# EAGLE schematic pi (EAGLE 9.6.2)
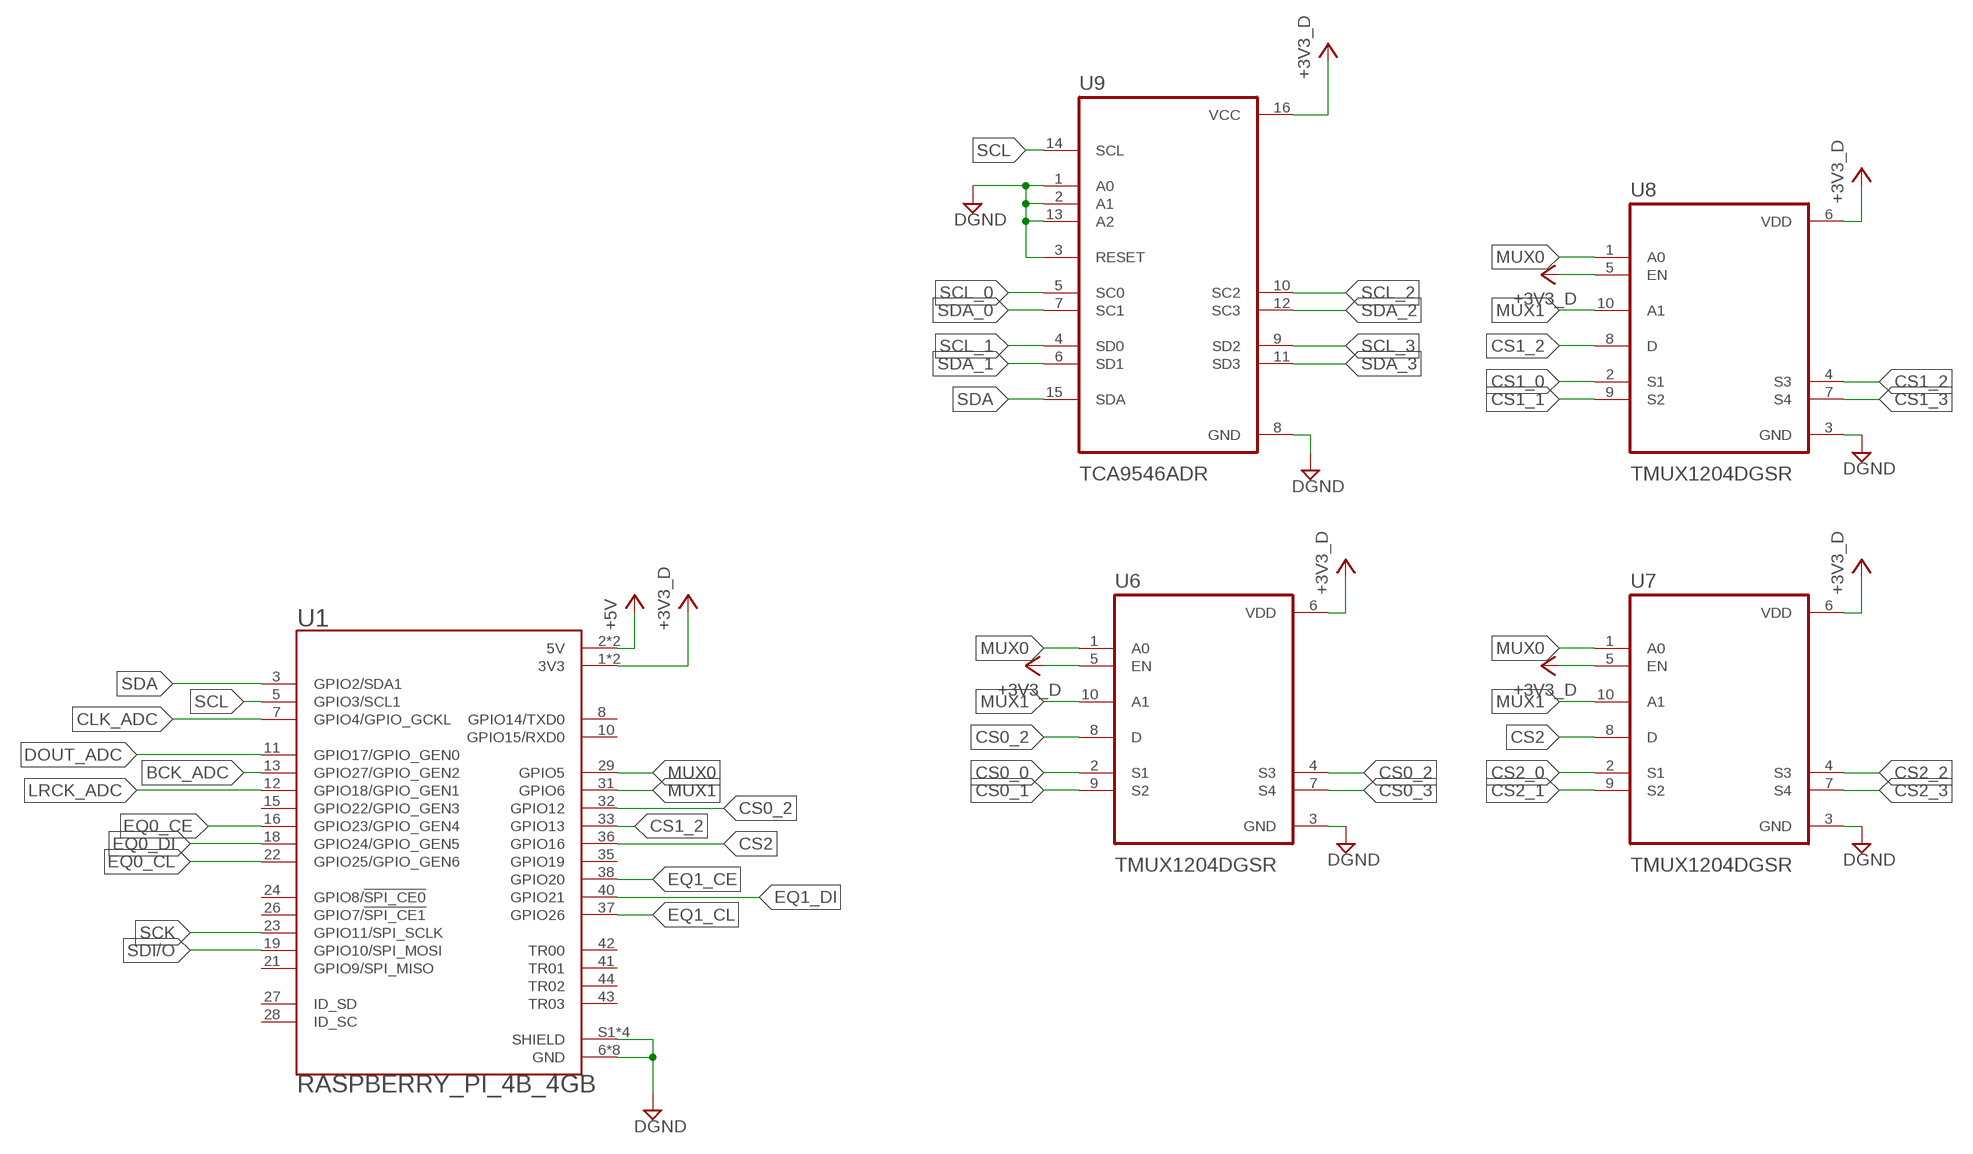
[diagram p0: schematic, sheet 1]

## Parts
U1  RASPBERRY_PI_4B_4GB  [MODULE_RASPBERRY_PI_4B_4GB]
U6  TMUX1204DGSR  [SOP50P490X110-10N]
U7  TMUX1204DGSR  [SOP50P490X110-10N]
U8  TMUX1204DGSR  [SOP50P490X110-10N]
U9  TCA9546ADR  [SOIC127P600X175-16N]

## Nets
+3V3: U1.1(3V3) U1.17(3V3) U6.5(EN) U6.6(VDD) U7.5(EN) U7.6(VDD) U8.5(EN) U8.6(VDD) U9.16(VCC) ; supply symbol labelled +3V3_D
+5V: U1.2(5V) U1.4(5V)
BCK_ADC: U1.13(GPIO27/GPIO_GEN2)
CLK_ADC: U1.7(GPIO4/GPIO_GCKL)
CS0_0: U6.2(S1)
CS0_1: U6.9(S2)
CS0_2: U1.32(GPIO12) U6.4(S3) U6.8(D)
CS0_3: U6.7(S4)
CS1_0: U8.2(S1)
CS1_1: U8.9(S2)
CS1_2: U1.33(GPIO13) U8.4(S3) U8.8(D)
CS1_3: U8.7(S4)
CS2: U1.36(GPIO16) U7.8(D)
CS2_0: U7.2(S1)
CS2_1: U7.9(S2)
CS2_2: U7.4(S3)
CS2_3: U7.7(S4)
DGND: U1.6(GND) U1.9(GND) U1.14(GND) U1.20(GND) U1.25(GND) U1.30(GND) U1.34(GND) U1.39(GND) U1.S1(SHIELD) U1.S2(SHIELD) U1.S3(SHIELD) U1.S4(SHIELD) U6.3(GND) U7.3(GND) U8.3(GND) U9.1(A0) U9.2(A1) U9.3(RESET) U9.8(GND) U9.13(A2)
DOUT_ADC: U1.11(GPIO17/GPIO_GEN0)
EQ0_CE: U1.16(GPIO23/GPIO_GEN4)
EQ0_CL: U1.22(GPIO25/GPIO_GEN6)
EQ0_DI: U1.18(GPIO24/GPIO_GEN5)
EQ1_CE: U1.38(GPIO20)
EQ1_CL: U1.37(GPIO26)
EQ1_DI: U1.40(GPIO21)
LRCK_ADC: U1.12(GPIO18/GPIO_GEN1)
MUX0: U1.29(GPIO5) U6.1(A0) U7.1(A0) U8.1(A0)
MUX1: U1.31(GPIO6) U6.10(A1) U7.10(A1) U8.10(A1)
SCK: U1.23(GPIO11/SPI_SCLK)
SCL: U1.5(GPIO3/SCL1) U9.14(SCL)
SCL_0: U9.5(SC0)
SCL_1: U9.4(SD0)
SCL_2: U9.10(SC2)
SCL_3: U9.9(SD2)
SDA: U1.3(GPIO2/SDA1) U9.15(SDA)
SDA_0: U9.7(SC1)
SDA_1: U9.6(SD1)
SDA_2: U9.12(SC3)
SDA_3: U9.11(SD3)
SDI/O: U1.19(GPIO10/SPI_MOSI)
Unconnected: U1.8(GPIO14/TXD0) U1.10(GPIO15/RXD0) U1.15(GPIO22/GPIO_GEN3) U1.21(GPIO9/SPI_MISO) U1.24(GPIO8/!SPI_CE0!) U1.26(GPIO7/!SPI_CE1!) U1.27(ID_SD) U1.28(ID_SC) U1.35(GPIO19) U1.41(TR01) U1.42(TR00) U1.43(TR03) U1.44(TR02)

## Library data of the parts
U1 = RASPBERRY_PI_4B_4GB:RASPBERRY_PI_4B_4GB: Check availability <https://pricing.snapeda.com/parts/RASPBERRY%20PI%204B/4GB/Raspberry%20Pi/view-part?ref=eda>; AVAILABILITY: Not in stock; CHECK_PRICES: https://www.snapeda.com/parts/RASPBERRY%20PI%204B/4GB/Raspberry+Pi/view-part/?ref=eda; DESCRIPTION: BCM2711 Raspberry Pi 4 Model B 4GB - ARM® Cortex®-A72 MPU Embedded Evaluation Board; MF: Raspberry Pi; MP: RASPBERRY PI 4B/4GB; PACKAGE: None; PRICE: None; SNAPEDA_LINK: https://www.snapeda.com/parts/RASPBERRY%20PI%204B/4GB/Raspberry+Pi/view-part/?ref=snap
U6-U8 = TMUX1204DGSR:TMUX1204DGSR: Check availability <https://pricing.snapeda.com/parts/TMUX1204DGSR/Texas%20Instruments/view-part?ref=eda>; AVAILABILITY: In Stock; CHECK_PRICES: https://www.snapeda.com/parts/TMUX1204DGSR/Texas+Instruments/view-part/?ref=eda; DESCRIPTION: 5-V, 4:1, 1-channel, general-purpose analog multiplexer; MF: Texas Instruments; MP: TMUX1204DGSR; PACKAGE: VSSOP-10 Texas Instruments; PRICE: None; PURCHASE-URL: https://www.snapeda.com/api/url_track_click_mouser/?unipart_id=3657556&manufacturer=Texas Instruments&part_name=TMUX1204DGSR&search_term=tmux1204; SNAPEDA_LINK: https://www.snapeda.com/parts/TMUX1204DGSR/Texas+Instruments/view-part/?ref=snap
U9 = TCA9546ADR:TCA9546ADR: Check availability <https://pricing.snapeda.com/parts/TCA9546ADR/Texas%20Instruments/view-part?ref=eda>; AVAILABILITY: In Stock; CHECK_PRICES: https://www.snapeda.com/parts/TCA9546ADR/Texas+Instruments/view-part/?ref=eda; DESCRIPTION: 4-channel 1.65- to 5.5-V I2C/SMBus switch with reset & voltage translation; MF: Texas Instruments; MP: TCA9546ADR; PACKAGE: SOIC-16 Texas Instruments; PRICE: None; PURCHASE-URL: https://www.snapeda.com/api/url_track_click_mouser/?unipart_id=424331&manufacturer=Texas Instruments&part_name=TCA9546ADR&search_term=None; SNAPEDA_LINK: https://www.snapeda.com/parts/TCA9546ADR/Texas+Instruments/view-part/?ref=snap